# EAGLE design uTracker (EAGLE 6.5.0)
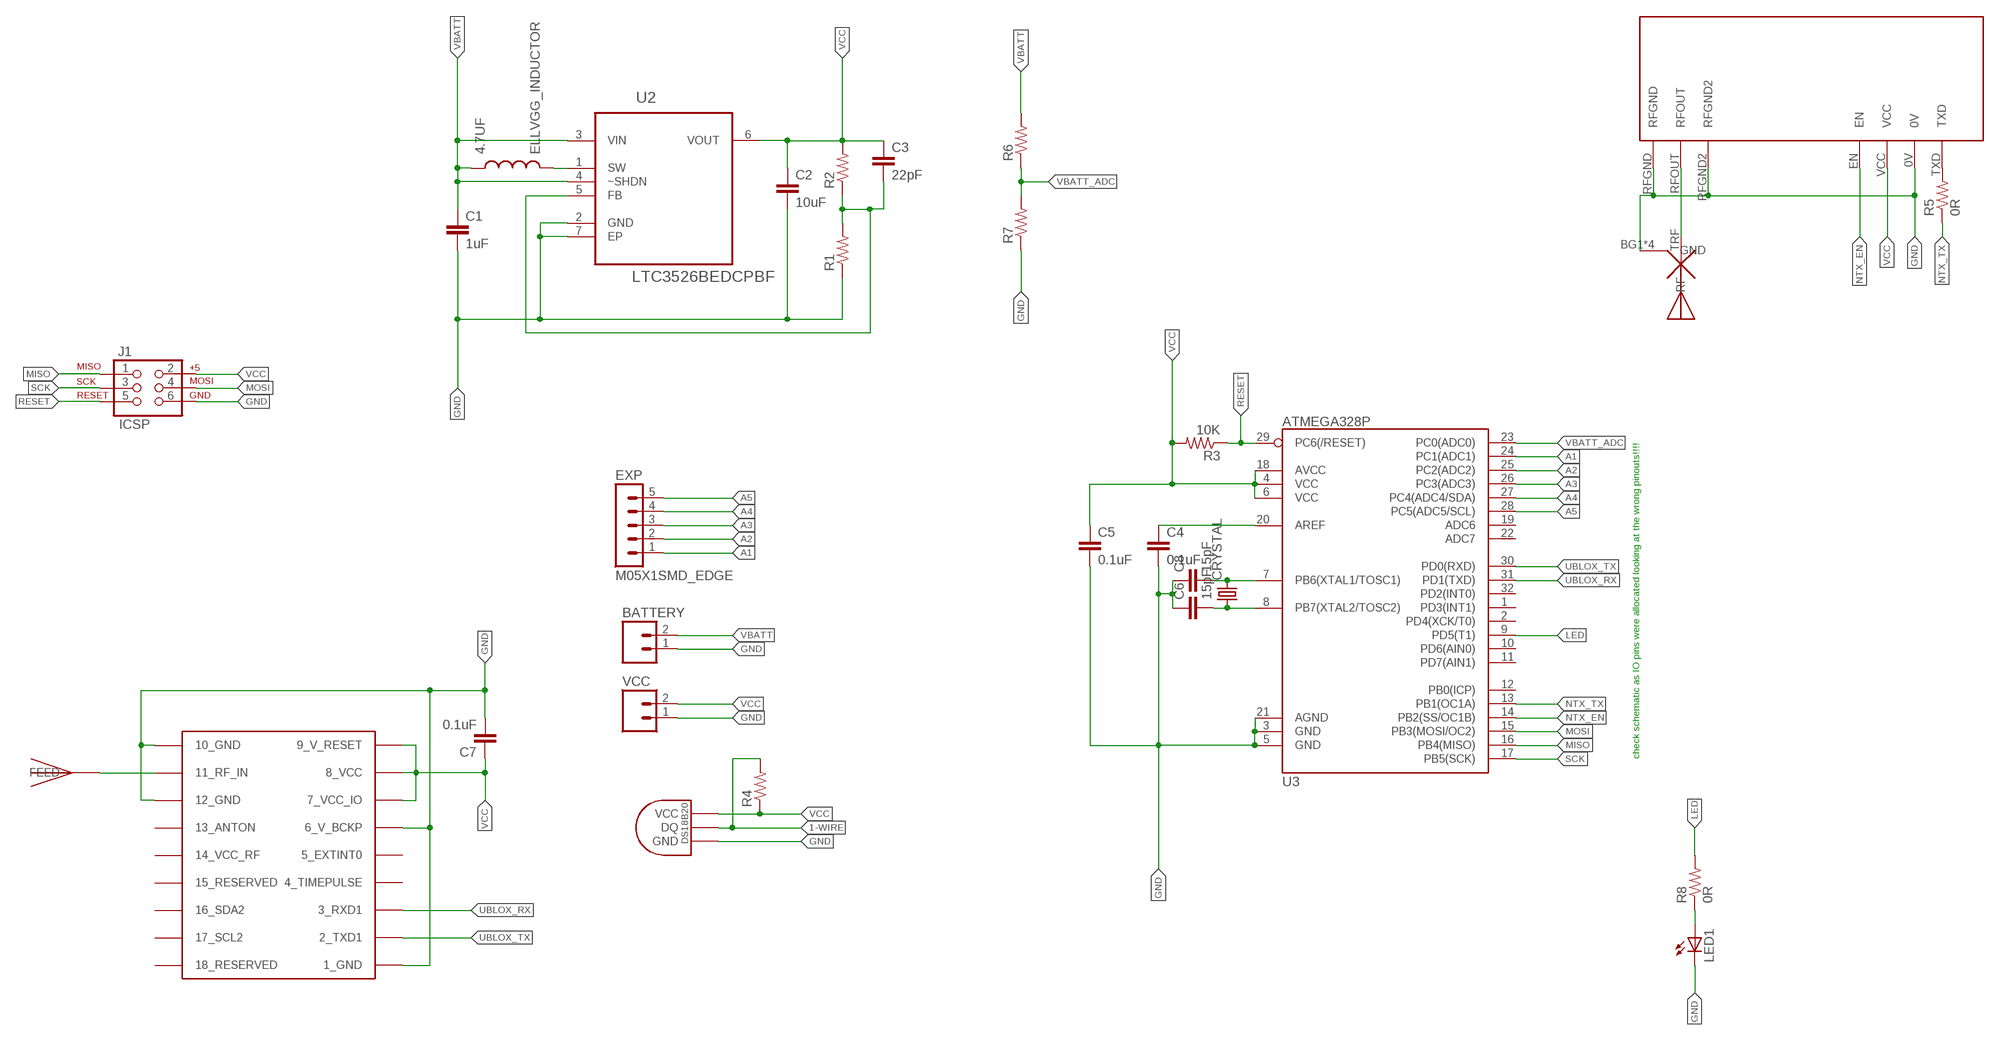
[diagram p0: schematic, sheet 1]

## Parts
4.7UF  ELLVGG_INDUCTOR  [ELLVGG_INDUCTOR]
BATTERY  M02PTH  [1X02]
C1  1uF  CAP0805  [0805]
C2  10uF  CAP0805  [0805]
C3  22pF  CAP0805  [0805]
C4  0.1uF  CAP0805  [0805]
C5  0.1uF  CAP0805  [0805]
C6  15pF  CAP0805  [0805]
C7  0.1uF  CAP0805  [0805]
C8  15pF  CAP0805  [0805]
CRYSTAL  ABRACON_ABM3_CRYSTALABM03_HC49  [ABM03_HC49]
EXP  M05X1SMD_EDGE  [M05_SMD_EDGE]
J1  ICSP  AVR_SPI_PRG_6SMD_EDGE  [ICSP_SMD_EDGE]
LED1  LED1206  [LED-1206]
R1  RESISTOR0805-RES  [0805]
R2  RESISTOR0805-RES  [0805]
R3  10K  RESISTOR0805-RES  [0805]
R4  RESISTOR0805-RES  [0805]
R5  0R  RESISTOR0805-RES  [0805]
R6  RESISTOR0805-RES  [0805]
R7  RESISTOR0805-RES  [0805]
R8  0R  RESISTOR0805-RES  [0805]
U2  LTC3526BEDCPBF  [DFN200X200X80-7N]
U3  ATMEGA328P  ATMEGA328_SMT  [TQFP32-08]
U$1  ANTENNA  [ANTCONN_GNDPL]
U$2  JTI_ANTENNA-1575AT43A40  [JTI_ANTENNA-1575AT43A40]
U$3  NTX2  [NTX2]
U$4  DS1820SOIC  [DS18B20_SOIC]
UBLOX  UBLOX_MAX-6  [UBLOX_MAX-6]
VCC  M02PTH  [1X02]

## Nets
1-WIRE: R4.2 U$4.DQ
A1: EXP.1 U3.24(PC1(ADC1))
A2: EXP.2 U3.25(PC2(ADC2))
A3: EXP.3 U3.26(PC3(ADC3))
A4: EXP.4 U3.27(PC4(ADC4/SDA))
A5: EXP.5 U3.28(PC5(ADC5/SCL))
GND: BATTERY.1 C1.2 C2.2 C4.2 C5.2 C6.1 C7.2 C8.1 J1.6 LED1.C R1.1 R7.1 U2.2(GND) U2.7(EP) U3.3(GND) U3.5(GND) U3.21(AGND) U$1.BG1(GND) U$1.BG2(GND) U$1.TG1(GND) U$1.TG2(GND) U$3.0V U$3.RFGND U$3.RFGND2 U$4.GND UBLOX.1_GND UBLOX.6_V_BCKP UBLOX.10_GND UBLOX.12_GND VCC.1
LED: R8.2 U3.9(PD5(T1))
MISO: J1.1 U3.16(PB4(MISO))
MOSI: J1.4 U3.15(PB3(MOSI/OC2))
N$1: C3.2 R1.2 R2.1 U2.5(FB)
N$2: U$2.FEED UBLOX.11_RF_IN
N$3: 4.7UF.P$2 U2.1(SW)
N$4: C4.1 U3.20(AREF)
N$5: R5.2 U$3.TXD
N$7: C8.2 CRYSTAL.2 U3.7(PB6(XTAL1/TOSC1))
N$8: C6.2 CRYSTAL.1 U3.8(PB7(XTAL2/TOSC2))
N$10: U$1.TRF(RF) U$3.RFOUT
N$13: LED1.A R8.1
NTX_EN: U3.14(PB2(SS/OC1B)) U$3.EN
NTX_TX: R5.1 U3.13(PB1(OC1A))
RESET: J1.5 R3.1 U3.29(PC6(/RESET))
SCK: J1.3 U3.17(PB5(SCK))
UBLOX_RX: U3.31(PD1(TXD)) UBLOX.3_RXD1
UBLOX_TX: U3.30(PD0(RXD)) UBLOX.2_TXD1
VBATT: 4.7UF.P$1 BATTERY.2 C1.1 R6.2 U2.3(VIN) U2.4(~SHDN)
VBATT_ADC: R6.1 R7.2 U3.23(PC0(ADC0))
VCC: C2.1 C3.1 C5.1 C7.1 J1.2 R2.2 R3.2 R4.1 U2.6(VOUT) U3.4(VCC) U3.6(VCC) U3.18(AVCC) U$3.VCC U$4.VCC UBLOX.7_VCC_IO UBLOX.8_VCC UBLOX.9_V_RESET VCC.2
Unconnected: U3.1(PD3(INT1)) U3.2(PD4(XCK/T0)) U3.10(PD6(AIN0)) U3.11(PD7(AIN1)) U3.12(PB0(ICP)) U3.19(ADC6) U3.22(ADC7) U3.32(PD2(INT0)) UBLOX.4_TIMEPULSE UBLOX.5_EXTINT0 UBLOX.13_ANTON UBLOX.14_VCC_RF UBLOX.15_RESERVED UBLOX.16_SDA2 UBLOX.17_SCL2 UBLOX.18_RESERVED

## Notes on the sheet
- check schematic as IO pins were allocated looking at the wrong pinouts!!!!

## Library data of the parts
4.7UF = Ava:ELLVGG_INDUCTOR
BATTERY VCC = SparkFun-Connectors:M02: Standard 2-pin 0.1" header. Use with - straight break away headers ( PRT-00116) - right angle break away headers (PRT-00553) - swiss pins (PRT-00743) - machine pins (PRT-00117) - female headers (PRT-00115) Molex polarized connector foot print use with: PRT-08233 with associated crimp pins and housings. 2.54_SCREWTERM for use with PRT-10571. 3.5mm Screw Terminal footprints for PRT-08084 5mm Screw Terminal footprints for use with PRT-08433
C1-C8 = SparkFun-Capacitors:CAP: Capacitor Standard 0603 ceramic capacitor, and 0.1" leaded capacitor.
CRYSTAL = Ava:ABRACON_ABM3_CRYSTAL
EXP = mjholmes:M05X1
J1 = mjholmes:AVR_SPI_PRG_6: AVR ISP 6 Pin This is the reduced ISP connector for AVR programming. Common on Arduino. This footprint will take up less PCB space and can be used with a 10-pin to 6-pin adapter such as SKU: BOB-08508
LED1 = SparkFun-LED:LED: LEDs Standard schematic elements and footprints for 5mm, 3mm, 1206, and 0603 sized LEDs. 5mm - Spark Fun Electronics SKU : COM-00529 (and others)
R1-R8 = SparkFun-Resistors:RESISTOR: Resistor Basic schematic elements and footprints for 0603, 1206, and PTH resistors.
U2 = Ava:LTC3526BEDCPBF: Low Dropout Linear Regulators; MPN: LTC3526BEDC#PBF; OC_FARNELL: 1858699; OC_NEWARK: 61R9521; PACKAGE: DFN-6; SUPPLIER: Linear Technology
U3 = SparkFun-DigitalIC:ATMEGA328_SMT: 32-Pin Atmega328 part Commonly used on Arduino compatible boards Available in QFP and QFN packages TQFP is IC-09069 QFN is non-stock; PROD_ID: IC-09069
U$1 = mjholmes:ANTENNA
U$2 = Ava:JTI_ANTENNA-1575AT43A40
U$3 = Ava:NTX2: Radiometrix NTX2 Transmitter Module Author Anthony Stirk / http://ava.upuaut.net
U$4 = Ava:DS1820: DS18B20 Programmable Resolution 1-Wire Digital Thermometer Description The DS18B20 digital thermometer provides 9-bit to 12-bit Celsius temperature measurements and has an alarm function with nonvolatile user-programmable upper and lower trigger points. The DS18B20 communicates over a 1-Wire® bus that by definition requires only one data line (and ground) for communication with a central microprocessor. It has an operating temperature range of -55°C to +125°C and is accurate to ±0.5°C over the range of -10°C to +85°C. In addition, the DS18B20 can derive power directly from the data line ("parasite power"), eliminating the need for an external power supply. Each DS18B20 has a unique 64-bit serial code, which allows multiple DS18B20s to function on the same 1-Wire bus. Thus, it is simple to use one microprocessor to control many DS18B20s distributed over a large area. Applications that can benefit from this feature include HVAC environmental controls, temperature monitoring systems inside buildings, equipment, or machinery, and process monitoring and control systems.
UBLOX = Ava:UBLOX_MAX-6: UBLOX MAX-6

## Board
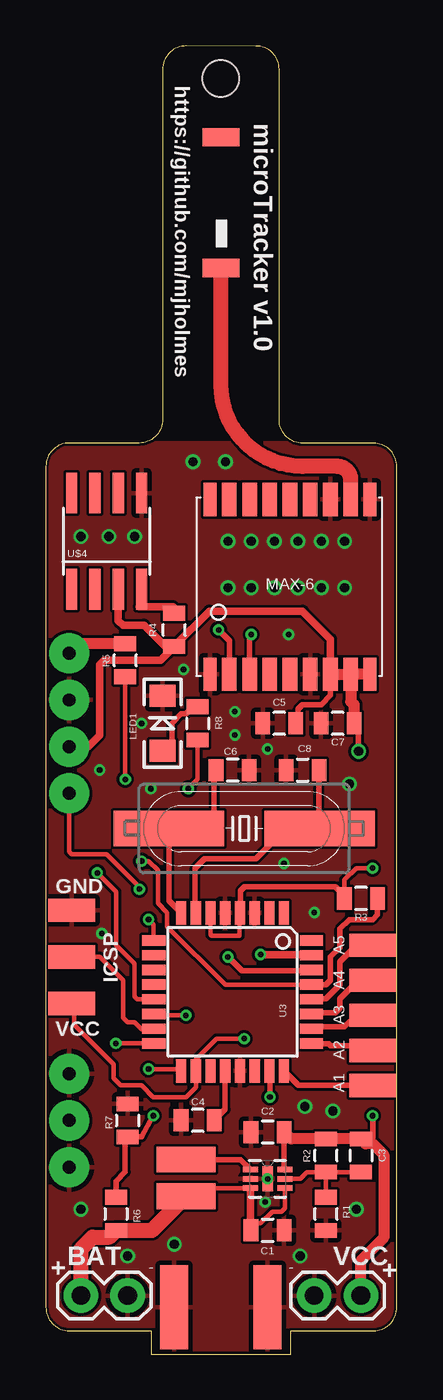
[diagram p1: board, top side]
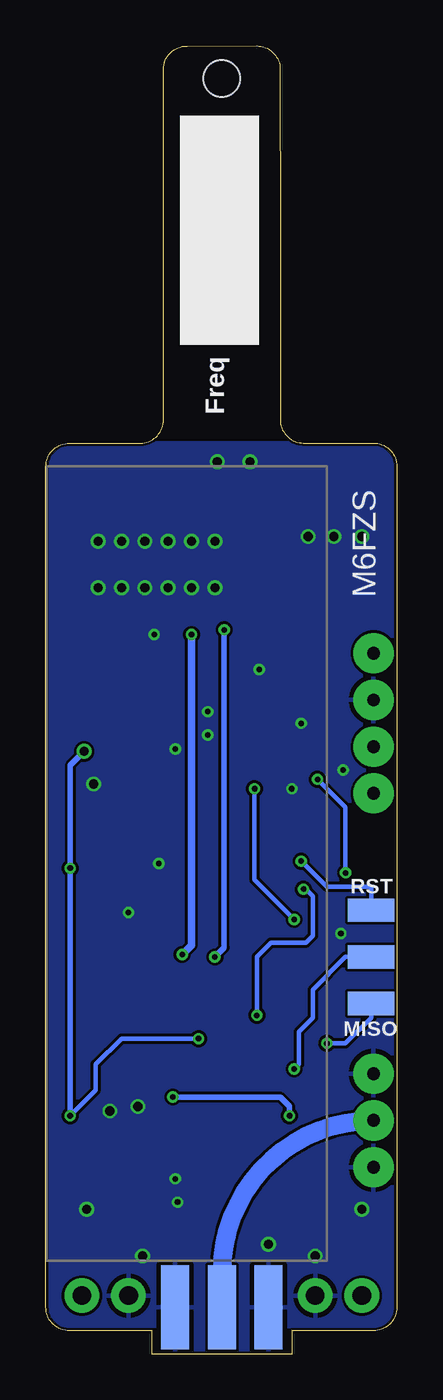
[diagram p2: board, bottom side, seen from below]

Size 19.1 x 71.12 mm. Coordinates in mm from the lower left corner, seen from the top.
Outline: 5.08,49.53 1.27,49.53 arc90 0,48.26 0,2.54 arc90 1.27,1.27 5.71,1.27 5.71,0 13.33,0 13.33,1.27 17.83,1.27 arc90 19.1,2.54 19.1,48.25 arc90 17.83,49.52 13.97,49.52 arc-90 12.7,50.79 12.7,64.76 arc0 12.7,64.76 12.7,66.03 12.7,69.84 arc90 11.43,71.11 7.62,71.12 arc90 6.35,69.85 6.35,66.04 6.35,64.77 6.35,50.8 arc-90 5.08,49.53
Copper layers (1*16): Top 0.035mm / dielectric 1.5mm / Bottom 0.035mm
Design rules "hackvana": minimum track width 6mil, minimum drill 0.3mm, track to track 6mil, track to pad 6mil, pad to pad 6mil, via to via 6mil, smd to smd 0mil, copper to edge 6mil, drill to drill 6mil, minimum pad ring 10mil, minimum via ring 6mil, stop-mask expansion 2mil, vias tented up to drill 100mil, thermal gap 10mil
Holes 2 mm at 9.53,69.34

### Footprints (pad centres in the part's own frame; a part is rotated, then mirrored left to right if it is on the bottom)
ELLVGG_INDUCTOR = smd 1.4 x 3.2: P$1 -0.953,0; P$2 1.048,0
1X02 = drill 1.016 pad 1.88: 1 0,0; 2 2.54,0
0805 = smd 0.8 x 1.2: 1 -0.9,0; 2 0.9,0
ABM03_HC49 = smd 6 x 1.93: 1 -4.1,0; 2 4.1,0
M05_SMD_EDGE = smd 1.27 x 2.54: 1 -3.81,0; 2 -1.905,0; 3 0,0; 4 1.905,0; 5 3.81,0
ICSP_SMD_EDGE = smd 1.27 x 2.54 bottom: 1 2.54,0; 3 0,0; 5 -2.54,0 | smd 1.27 x 2.54: 2 2.54,0; 4 0,0; 6 -2.54,0
LED-1206 = smd 1.2 x 1.4: A -1.5,0; C 1.5,0
DFN200X200X80-7N = smd 0.813 x 0.305: 1 -0.94,0.508; 2 -0.94,0; 3 -0.94,-0.508; 4 0.94,-0.508; 5 0.94,0; 6 0.94,0.508 | smd 0.559 x 1.372: 7 0,0
TQFP32-08 = smd 1.27 x 0.559: 1 -4.293,2.8; 2 -4.293,2; 3 -4.293,1.2; 4 -4.293,0.4; 5 -4.293,-0.4; 6 -4.293,-1.2; 7 -4.293,-2; 8 -4.293,-2.8; 17 4.293,-2.8; 18 4.293,-2; 19 4.293,-1.2; 20 4.293,-0.4; 21 4.293,0.4; 22 4.293,1.2; 23 4.293,2; 24 4.293,2.8 | smd 0.559 x 1.27: 9 -2.8,-4.293; 10 -2,-4.293; 11 -1.2,-4.293; 12 -0.4,-4.293; 13 0.4,-4.293; 14 1.2,-4.293; 15 2,-4.293; 16 2.8,-4.293; 25 2.8,4.293; 26 2,4.293; 27 1.2,4.293; 28 0.4,4.293; 29 -0.4,4.293; 30 -1.2,4.293; 31 -2,4.293; 32 -2.8,4.293
ANTCONN_GNDPL = smd 1.524 x 4.572 bottom: BG1 -2.54,0; BG2 2.54,0; TRF 0,0 | smd 1.524 x 4.572: TG1 -2.54,0; TG2 2.54,0
JTI_ANTENNA-1575AT43A40 = smd 1 x 2: FEED -3.175,0; NC 3.925,0
NTX2 = drill 0.7 pad 2.184: 0V -2.54,-10.16; EN -7.62,-10.16; RFGND -22.86,-10.16; RFGND2 -27.94,-10.16; RFOUT -25.4,-10.16; TXD 0,-10.16; VCC -5.08,-10.16
DS18B20_SOIC = smd 0.61 x 2.21: DQ 1.905,-2.616; GND 1.905,2.616; NC -1.905,-2.616; NC2 -0.635,-2.616; NC3 -1.905,2.616; NC4 -0.635,2.616; NC5 0.635,2.616; VCC 0.635,-2.616
UBLOX_MAX-6 = smd 1.8 x 0.7: 1_GND 4.95,-4.4; 9_V_RESET 4.95,4.3; 10_GND -4.55,4.3; 18_RESERVED -4.55,-4.4 | smd 1.8 x 0.8: 2_TXD1 4.95,-3.35; 3_RXD1 4.95,-2.25; 4_TIMEPULSE 4.95,-1.15; 5_EXTINT0 4.95,-0.05; 6_V_BCKP 4.95,1.05; 7_VCC_IO 4.95,2.15; 8_VCC 4.95,3.25; 11_RF_IN -4.55,3.25; 12_GND -4.55,2.15; 13_ANTON -4.55,1.05; 14_VCC_RF -4.55,-0.05; 15_RESERVED -4.55,-1.15; 16_SDA2 -4.55,-2.25; 17_SCL2 -4.55,-3.35

### Placement (x,y rotation side)
4.7UF  7.62,9.53 90 top
BATTERY  4.45,3.17 180 top
C1  12.06,6.73 0 top
C2  12.06,12.06 180 top
C3  17.14,10.79 270 top
C4  8.25,12.7 180 top
C5  12.7,34.29 180 top
C6  10.16,31.75 180 top
C7  15.87,34.29 180 top
C8  13.97,31.75 0 top
CRYSTAL  10.79,28.57 0 top
EXP  17.78,18.41 90 top
J1  1.4,21.59 270 top
LED1  6.35,34.29 90 top
R1  15.24,7.62 90 top
R2  15.24,10.79 90 top
R3  17.14,24.77 180 top
R4  6.98,39.37 90 top
R5  4.32,37.72 90 top
R6  3.81,7.62 270 top
R7  4.45,12.7 270 top
R8  8.25,34.29 270 top
U2  12.06,9.53 0 top
U3  10.16,19.68 270 top
U$1  9.53,2.54 180 top
U$2  9.53,62.23 90 top
U$3  11.43,38.1 90 bottom
U$4  3.3,44.2 0 top
UBLOX  13.33,41.91 270 top
VCC  14.6,3.17 0 top

### Tracks (layer width: path | path; a pad name or v marks a point on that pad's centre or on a via)
1-WIRE
  Top 0.305: 6.98,40.56 R4.2
  Top 0.406: 6.98,40.56 6.91,40.64 5.08,40.64 5.21,40.77 U$4.DQ
A1
  Top 0.305: U3.24 13.75,14.61 EXP.1
A2
  Top 0.305: 14.57,16.76 U3.25 14.47,16.87 15.39,16.87 15.49,16.76 17.27,16.76 17.53,16.51 EXP.2
A3
  Top 0.305: U3.26 14.55,17.78 16.26,17.78 16.89,18.41 EXP.3
A4
  Top 0.305: U3.27 14.51,18.54 15.75,18.54 16,18.8 16,19.3 17.02,20.32 EXP.4
A5
  Top 0.305: U3.28 14.47,19.3 15.24,19.3 16,20.07 16,21.34 16.89,22.23 EXP.5
GND  (via drill 0.3, 0.5 pad 0.25)
  other vias: 13.21,39.12 14.99,44.2 12.95,26.67 16.51,30.99 14.6,24 12.06,32.89 7.49,37.21 13.72,44.2 9.91,44.2 11.18,44.2 12.45,44.2 16.26,44.2 14.99,41.66 13.72,41.66 9.91,41.66 11.18,41.66 12.45,41.66 16.26,41.66 2.92,31.75 3.05,22.86 14.1,13.46 15.62,13.21 16.89,7.87 6.98,5.97 13.84,5.33 4.45,5.33 1.9,7.87 3.43,44.45 8,48.51 12.06,9.53 9.78,48.51 4.83,44.45 1.9,44.45 10.29,34.92 10.29,33.66 5.71,30.73 5.21,34.29 11.94,8.26
  pour Bottom: 0,49.53 0,0 19.05,0 19.05,49.53
  pour Top: 0,49.53 19.05,49.53 19.05,0 0,0
LED  (via drill 0.3)
  Top 0.254: U3.9 5.87,23.34 v5.59,23.62 | v7.75,30.73 8.25,31.24 R8.2
  Bottom 0.254: v5.59,23.62 7.75,25.78 v7.75,30.73
MISO  (via drill 0.3)
  Top 0.254: U3.16 v3.81,16.89
  Bottom 0.254: v3.81,16.89 2.79,16.89 1.4,18.29 J1.1
MOSI
  Top 0.254: J1.4 2.92,21.59 4.19,20.32 4.19,18.29 4.45,18.03 4.83,18.03 5.21,17.65 5.83,17.65 U3.15
N$1
  Top 0.254: U2.5 13.84,9.53 14.21,9.89 R2.1 | R2.1 C3.2 | R2.1 R1.2
N$2
  Top 0.813: UBLOX.11_RF_IN 16.59,47.55 arc90 15.87,48.26 13.97,48.26 arc-90 9.53,52.7 U$2.FEED
N$3
  Top 0.305: U2.1 10.59,10.57 4.7UF.P$2
N$4
  Top 0.305: C4.1 9.76,13.3 U3.20
N$5
  Top 0.61: R5.2 4.31,38.61 1.52,38.61 1.27,38.35 U$3.TXD
N$7
  Top 0.305: U3.7 8.13,24.01 8.13,26.42 8.64,26.92 11.43,26.92 13.08,28.57 CRYSTAL.2 14.87,28.6 C8.2
N$8
  Top 0.305: U3.8 6.7,24.64 CRYSTAL.1 8.76,28.57 9.14,28.96 9.14,31.63 C6.2
N$10
  Bottom 1.016: U$3.RFOUT arc-90 9.53,4.45 U$1.TRF
N$13
  Top 0.305: LED1.A 6.86,33.3 6.86,34.29 7.37,34.8 7.62,34.8 8.01,35.19 R8.1
NTX_EN  (via drill 0.3)
  Top 0.254: U3.14 5.94,18.41 v7.62,18.41 | v5.08,25.27 5.08,25.4 3.3,27.18 1.4,27.18 1.27,27.3 U$3.EN
  Bottom 0.254: v7.62,18.41 7.62,21.59 6.86,22.35 4.95,22.35 4.57,22.73 4.57,24.89 4.95,25.27 v5.08,25.27
NTX_TX  (via drill 0.3)
  Top 0.254: R5.1 4.32,31.62 v4.32,31.24 | U3.13 4.97,19.29 4.83,19.43 4.83,21.21 3.81,22.23 3.81,25.15 v2.79,26.16
  Bottom 0.254: v2.79,26.16 2.79,29.72 v4.32,31.24
RESET  (via drill 0.3)
  Top 0.254: v5.21,26.8 5.59,26.8 6.1,26.29 6.1,24.51 6.6,24 6.6,23.24 9.78,20.07 14.43,20.07 U3.29
  Top 0.305: U3.29 14.47,20.07 15.24,20.07 15.49,20.32 15.49,21.59 16,22.1 16,23.11 16.51,23.62 17.78,23.62 18.05,23.89 R3.1
  Bottom 0.254: J1.5 1.4,25.4 3.81,25.4 v5.21,26.8
SCK  (via drill 0.3)
  Top 0.254: U3.17 7.26,15.49 v5.59,15.49
  Bottom 0.254: v5.59,15.49 5.33,15.75 5.33,17.53 4.57,18.29 4.57,19.81 2.79,21.59 J1.3
UBLOX_RX  (via drill 0.3)
  Top 0.305: v11.18,39.12 11.08,39.02 UBLOX.3_RXD1
  Top 0.406: U3.31 14.42,21.72 v11.68,21.72
  Bottom 0.406: v11.68,21.72 11.18,22.23 v11.18,39.12
UBLOX_TX  (via drill 0.3)
  Top 0.305: U3.30 14.4,20.83 10.67,20.83 v9.91,21.59 | v9.4,39.37 9.98,38.78 UBLOX.2_TXD1
  Bottom 0.305: v9.91,21.59 9.4,22.1 v9.4,39.37
VBATT
  Top 0.254: 13.01,8.69 U2.4 13.01,7.92 12.83,7.75 12.32,7.75 11.68,7.11 11.55,7.11 C1.1 | 4.7UF.P$1 8.45,8.57 8.89,9.02 U2.3
  Top 0.406: U2.3 11.12,7.03 C1.1
  Top 0.813: BATTERY.2 1.9,5.71 2.54,6.35 3.44,6.35 R6.2 5.77,6.72 4.7UF.P$1
VBATT_ADC  (via drill 0.3)
  Top 0.305: R6.1 3.81,9.4 4.32,9.91 4.32,11.67 R7.2 5.2,11.8 v5.84,12.95 | v12.19,13.97 12.19,15.36 U3.23
  Bottom 0.305: v5.84,12.95 5.84,13.46 6.35,13.97 v12.19,13.97
VCC  (via drill 0.3, 0.5 pad 0.25)
  Top 0.254: 16.25,24.9 16.26,24.91 16.26,25.78 16.89,26.42 v17.78,26.42 | J1.2 1.52,19.43 1.52,17.91 3.68,15.75 3.68,14.99 4.06,14.61 5.21,14.61 5.84,13.97 7.62,13.97 8.16,14.51 U3.18 8.16,16.03 9.27,17.14 v10.79,17.14 | U3.6 8.96,22.79 9.02,22.73 10.54,22.73 10.54,23.96 U3.4
  Top 0.305: C2.1 12.96,10.07 | U3.18 8.13,15.42 | C7.1 17.02,34.05 v17.02,32.77 | v17.78,12.95 17.78,11.43 | C5.1 13.72,34.41 13.72,35.05 13.97,35.31 14.99,35.31 15.49,35.8 UBLOX.7_VCC_IO | 10.67,24.09 U3.4 10.59,24.01 10.59,25.2 10.79,25.4 15.75,25.4 16.25,24.9 R3.2
  Top 0.406: 12.96,10.07 U2.6 | U$3.VCC 2.29,33.02 2.92,33.66 2.92,37.47 3.18,37.72 6.23,37.72 6.61,38.09 | 6.61,38.09 R4.1 8.9,40.39 13.97,40.39 15.49,38.87 UBLOX.7_VCC_IO | U$4.VCC 3.94,39.88 4.19,39.62 5.33,39.62 6.61,38.35 6.61,38.09
  Top 0.61: VCC.2 17.14,5.08 18.42,6.35 18.42,10.79 17.78,11.43 17.41,11.43 C3.1 R2.2 13.33,11.7 C2.1 | UBLOX.7_VCC_IO UBLOX.8_VCC | UBLOX.9_V_RESET UBLOX.8_VCC | UBLOX.8_VCC 16.59,35.48 16.76,35.31 16.76,34.3 C7.1
  Bottom 0.254: v10.79,17.14 14.99,17.14 16.38,15.75 16.38,14.35 v17.78,12.95
  Bottom 0.305: v17.02,32.77 17.78,32 v17.78,26.42 v17.78,12.95

### Text on the board
tPlace: https://github.com/mjholmes | microTracker v1.0 | GND | ICSP | VCC | BAT | VCC | + | +
bPlace: Freq | M6FZS | RST | MISO
tNames: A5 | A4 | A3 | A2 | A1 | - | -